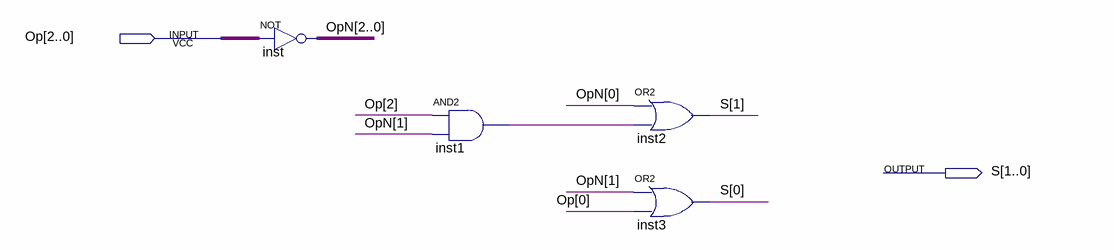
[diagram p0: schematic sheet]
// Quartus schematic ChangeOP.bdf as structural Verilog: 4 symbols, 2 pins
module ChangeOP (
  input  [2:0] Op,
  output [1:0] S
);

  wire inst1_out;
  wire [2:0] OpN;

  assign OpN = ~Op;  // NOT inst, 3 bits wide
  and inst1 (inst1_out, Op[2], OpN[1]);
  or inst2 (S[1], OpN[0], inst1_out);
  or inst3 (S[0], OpN[1], Op[0]);
endmodule
